# EAGLE schematic carte_ascenseur_v2 (EAGLE 6.4)
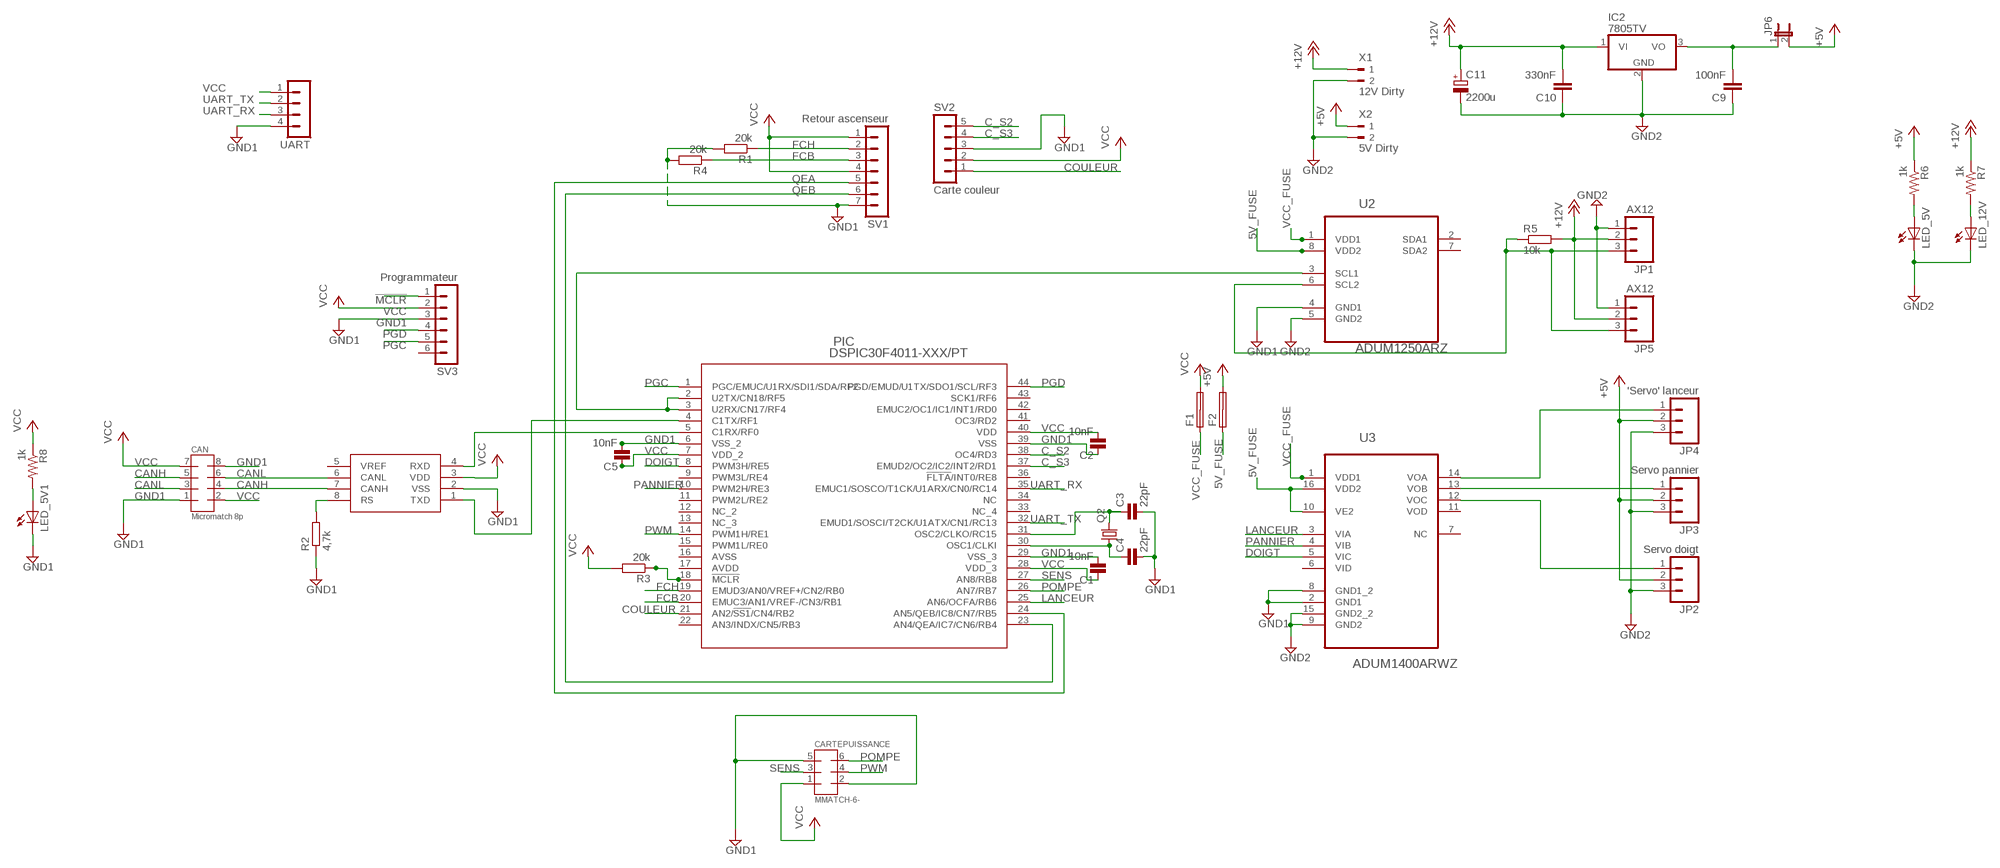
[diagram p0: schematic, sheet 1]

## Parts
C1  10nF  C0805  [0805]
C2  10nF  C0805  [0805]
C3  22pF  C0805  [0805]
C4  22pF  C0805  [0805]
C5  10nF  C0805  [0805]
C9  100nF  C-EUC0805  [C0805]
C10  330nF  C-EUC0805  [C0805]
C11  2200u  CPOL-EUTT5D11  [TT5D11]
CAN  Micromatch 8p  MMATCH-8-PTH  [AMP-215079-8]
CARTEPUISSANCE  MMATCH-6-  [AMP-215079-6]
F1  SHK20Q  [SHK20Q]
F2  SHK20Q  [SHK20Q]
IC2  7805TV  [TO220V]
JP1  AX12  M03POLAR  [MOLEX-1X3]
JP2  Servo doigt  M03PTH  [1X03]
JP3  Servo pannier  M03PTH  [1X03]
JP4  'Servo' lanceur  M03PTH  [1X03]
JP5  AX12  M03POLAR  [MOLEX-1X3]
JP6  JP1E  [JP1]
LED_5V  LEDCHIPLED_0805  [CHIPLED_0805]
LED_5V1  LEDCHIPLED_0805  [CHIPLED_0805]
LED_12V  LEDCHIPLED_0805  [CHIPLED_0805]
PIC  DSPIC30F4011-XXX/PT  [TQFP44_MC]
Q2  CRYSTALHC49S  [HC49/S]
R1  20k  R-EU_M0805  [M0805]
R2  4,7k  R-EU_M0805  [M0805]
R3  20k  R-EU_M0805  [M0805]
R4  20k  R-EU_M0805  [M0805]
R5  10k  R-EU_M0805  [M0805]
R6  1k  RESISTOR0805-RES  [0805]
R7  1k  RESISTOR0805-RES  [0805]
R8  1k  RESISTOR0805-RES  [0805]
SV1  Retour ascenseur  MA07-1  [MA07-1]
SV2  Carte couleur  MA05-1  [MA05-1]
SV3  Programmateur  MA06-1  [MA06-1]
U1  MCP2551  [SO08]
U2  ADUM1250ARZ  [SOIC127P600X175-8N]
U3  ADUM1400ARWZ  [SOIC127P1032X265-16N]
UART  MA04-1  [MA04-1]
X1  12V Dirty  90-2  [90-2]
X2  5V Dirty  90-2  [90-2]

## Nets
5V_FUSE: F2.1A U2.8(VDD2) U3.10(VE2) U3.16(VDD2)
!MCLR!: PIC.18(!MCLR!) R3.1 SV3.1
+5V: F2.2A JP2.2 JP3.2 JP4.2 JP6.2 R6.1 X2.1
+12V: C10.2 C11.+ IC2.1(VI) JP1.2 JP5.2 R5.2 R7.1 X1.1
C_S2: PIC.38(OC4/RD3) SV2.5
C_S3: PIC.37(EMUD2/OC2/IC2/INT2/RD1) SV2.4
CANH: CAN.4 CAN.5 U1.7(CANH)
CANL: CAN.3 CAN.6 U1.6(CANL)
COULEUR: PIC.21(AN2/!SS1!/CN4/RB2) SV2.1
DOIGT: PIC.8(PWM3H/RE5) U3.5(VIC)
FCB: PIC.20(EMUC3/AN1/VREF-/CN3/RB1) R4.1 SV1.3
FCH: PIC.19(EMUD3/AN0/VREF+/CN2/RB0) R1.1 SV1.2
GND1: C1.2 C2.1 C3.2 C4.2 C5.2 CAN.1 CAN.8 CARTEPUISSANCE.2 CARTEPUISSANCE.5 LED_5V1.C PIC.6(VSS_2) PIC.29(VSS_3) PIC.39(VSS) R1.2 R2.1 R4.2 SV1.7 SV2.3 SV3.3 U1.2(VSS) U2.4(GND1) U3.2(GND1) U3.8(GND1_2) UART.4
GND2: C9.1 C10.1 C11.- IC2.2(GND) JP1.1 JP2.3 JP3.3 JP4.3 JP5.1 LED_5V.C LED_12V.C U2.5(GND2) U3.9(GND2) U3.15(GND2_2) X1.2 X2.2
LANCEUR: PIC.25(AN6/OCFA/RB6) U3.3(VIA)
N$1: PIC.4(C1TX/RF1) U1.1(TXD)
N$2: LED_5V.A R6.2
N$3: PIC.5(C1RX/RF0) U1.4(RXD)
N$4: R2.2 U1.8(RS)
N$6: C9.2 IC2.3(VO) JP6.1
N$7: PIC.2(U2TX/CN18/RF5) PIC.3(U2RX/CN17/RF4) U2.3(SCL1)
N$8: JP4.1 U3.14(VOA)
N$9: JP3.1 U3.13(VOB)
N$10: JP2.1 U3.12(VOC)
N$11: LED_12V.A R7.2
N$12: LED_5V1.A R8.2
N$15: C3.1 PIC.31(OSC2/CLKO/RC15) Q2.2
N$16: JP1.3 JP5.3 R5.1 U2.6(SCL2)
N$18: C4.1 PIC.30(OSC1/CLKI) Q2.1
PANNIER: PIC.10(PWM2H/RE3) U3.4(VIB)
PGC: PIC.1(PGC/EMUC/U1RX/SDI1/SDA/RF2) SV3.5
PGD: PIC.44(PGD/EMUD/U1TX/SDO1/SCL/RF3) SV3.4
POMPE: CARTEPUISSANCE.6 PIC.26(AN7/RB7)
PWM: CARTEPUISSANCE.4 PIC.14(PWM1H/RE1)
QEA: PIC.24(AN5/QEB/IC8/CN7/RB5) SV1.5
QEB: PIC.23(AN4/QEA/IC7/CN6/RB4) SV1.6
SENS: CARTEPUISSANCE.3 PIC.27(AN8/RB8)
UART_RX: PIC.35(EMUC1/SOSCO/T1CK/U1ARX/CN0/RC14) UART.3
UART_TX: PIC.32(EMUD1/SOSCI/T2CK/U1ATX/CN1/RC13) UART.2
VCC: C1.1 C2.2 C5.1 CAN.2 CAN.7 CARTEPUISSANCE.1 F1.2A PIC.7(VDD_2) PIC.28(VDD_3) PIC.40(VDD) R3.2 R8.1 SV1.1 SV1.4 SV2.2 SV3.2 U1.3(VDD) UART.1
VCC_FUSE: F1.1A U2.1(VDD1) U3.1(VDD1)
Unconnected: F1.1B F1.2B F2.1B F2.2B PIC.9(PWM3L/RE4) PIC.11(PWM2L/RE2) PIC.12(NC_2) PIC.13(NC_3) PIC.15(PWM1L/RE0) PIC.16(AVSS) PIC.17(AVDD) PIC.22(AN3/INDX/CN5/RB3) PIC.33(NC_4) PIC.34(NC) PIC.36(!FLTA!/INT0/RE8) PIC.41(OC3/RD2) PIC.42(EMUC2/OC1/IC1/INT1/RD0) PIC.43(SCK1/RF6) SV3.6 U1.5(VREF) U2.2(SDA1) U2.7(SDA2) U3.6(VID) U3.7(NC) U3.11(VOD)

## Library data of the parts
C1-C5 = mbed-rlcq:C
C9 C10 = rcl:C-EU: CAPACITOR, European symbol
C11 = rcl:CPOL-EU: POLARIZED CAPACITOR, European symbol
CAN = jt-con-micromatch:MMATCH-8-*: AMP Micromatch 8-pin
CARTEPUISSANCE = jt-con-micromatch:MMATCH-6-*
F1 F2 = fuse:SHK20Q: FUSE HOLDER 5 x 20 mm, SH contact, E1207 Buerklin 64G6061; OC_FARNELL: unknown; OC_NEWARK: unknown
IC2 = linear:78*: Positive VOLTAGE REGULATOR Source: http://cache.national.com/ds/LM/LM78L05.pdf http://www.fairchildsemi.com/ds/LM/LM7805.pdf
JP1-JP5 = SparkFun-Connectors:M03: Header 3 Standard 3-pin 0.1" header. Use with straight break away headers (SKU : PRT-00116), right angle break away headers (PRT-00553), swiss pins (PRT-00743), machine pins (PRT-00117), and female headers (PRT-00115). Molex polarized connector foot print use with SKU : PRT-08232 with associated crimp pins and housings.
JP6 = jumper:JP1E: JUMPER
LED_5V LED_5V1 LED_12V = adafruit:LED: LED OSRAM: - CHIPLED LG R971, LG N971, LY N971, LG Q971, LY Q971, LO R971, LY R971 LH N974, LH R974 LS Q976, LO Q976, LY Q976 LO Q996 - Hyper CHIPLED LW Q18S LB Q993, LB Q99A, LB R99A - SideLED LS A670, LO A670, LY A670, LG A670, LP A670 LB A673, LV A673, LT A673, LW A673 LH A674 LY A675 LS A676, LA A676, LO A676, LY A676, LW A676 LS A679, LY A679, LG A679 - Hyper Micro SIDELED® LS Y876, LA Y876, LO Y876, LY Y876 LT Y87S - SmartLED LW L88C, LW L88S LB L89C, LB L89S, LG L890 LS L89K, LO L89K, LY L89K LS L896, LA L896, LO L896, LY L896 - TOPLED LS T670, LO T670, LY T670, LG T670, LP T670 LSG T670, LSP T670, LSY T670, LOP T670, LYG T670 LG T671, LOG T671, LSG T671 LB T673, LV T673, LT T673, LW T673 LH T674 LS T676, LA T676, LO T676, LY T676, LB T676, LH T676, LSB T676, LW T676 LB T67C, LV T67C, LT T67C, LS T67K, LO T67K, LY T67K, LW E67C LS E67B, LA E67B, LO E67B, LY E67B, LB E67C, LV E67C, LT E67C LW T67C LS T679, LY T679, LG T679 LS T770, LO T770, LY T770, LG T770, LP T770 LB T773, LV T773, LT T773, LW T773 LH T774 LS E675, LA E675, LY E675, LS T675 LS T776, LA T776, LO T776, LY T776, LB T776 LHGB T686 LT T68C, LB T68C - Hyper Mini TOPLED® LB M676 - Mini TOPLED Santana® LG M470 LS M47K, LO M47K, LY M47K Source: http://www.osram.convergy.de/
PIC = UL-PIC:DSPIC30F4011-XXX/PT
Q2 = crystal:CRYSTAL: CRYSTAL; OC_FARNELL: 1667008; OC_NEWARK: unknown
R1-R5 = rcl:R-EU_: RESISTOR, European symbol
R6-R8 = SparkFun-Passives:RESISTOR: Resistor Basic schematic elements and footprints for 0603, 1206, and PTH resistors.; OC_FARNELL: unknown
SV1 = con-lstb:MA07-1: PIN HEADER; OC_FARNELL: unknown; OC_NEWARK: unknown
SV2 = con-lstb:MA05-1: PIN HEADER; OC_FARNELL: unknown; OC_NEWARK: unknown
SV3 = con-lstb:MA06-1: PIN HEADER; OC_FARNELL: unknown; OC_NEWARK: unknown
U1 = SparkFun-DigitalIC:MCP2551: CAN transceiver
U2 = Analog Devices_By_element14_Batch_1:ADUM1250ARZ: Hot Swappable, Dual I2C Isolators; MPN: ADUM1250ARZ; OC_FARNELL: 1814353; OC_NEWARK: 27M9880; PACKAGE: SOIC-8; SUPPLIER: Analog Devices
U3 = Analog Devices_By_element14_Batch_1:ADUM1400ARWZ: Quad-Channel Digital Isolators; MPN: ADUM1400ARWZ; OC_FARNELL: 1226217; OC_NEWARK: 19M8755; PACKAGE: SOIC-16; SUPPLIER: Analog Devices
UART = con-lstb:MA04-1: PIN HEADER; OC_FARNELL: unknown; OC_NEWARK: unknown
X1 X2 = con-weidmueller-sl35:90-2: WEIDMUELLER CLAMP CONNECTOR; OC_FARNELL: unknown; OC_NEWARK: unknown

## Net classes
1 +5V: width 0.6 mm, drill 0.2 mm, clearance 0.4 mm